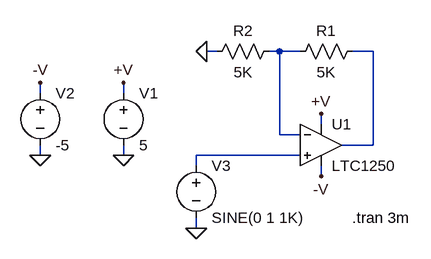
[diagram p0: schematic 1250.asc]
1250.asc, the LTspice schematic file:
Version 4
SHEET 1 896 680
WIRE 32 96 16 96
WIRE 128 96 112 96
WIRE 160 96 128 96
WIRE 272 96 240 96
WIRE -240 160 -240 144
WIRE -112 160 -112 144
WIRE 192 208 192 192
WIRE 128 224 128 96
WIRE 160 224 128 224
WIRE 272 240 272 96
WIRE 272 240 224 240
WIRE -240 256 -240 240
WIRE -112 256 -112 240
WIRE 160 256 0 256
WIRE 0 272 0 256
WIRE 192 288 192 272
WIRE 0 368 0 352
FLAG -112 256 0
FLAG 192 192 +V
FLAG -112 144 +V
FLAG 192 288 -V
FLAG -240 256 0
FLAG -240 144 -V
FLAG 16 96 0
FLAG 0 368 0
SYMBOL voltage -112 144 R0
SYMATTR InstName V1
SYMATTR Value 5
SYMBOL voltage -240 144 R0
SYMATTR InstName V2
SYMATTR Value -5
SYMBOL res 256 80 R90
WINDOW 0 0 56 VBottom 2
WINDOW 3 32 56 VTop 2
SYMATTR InstName R1
SYMATTR Value 5K
SYMBOL res 128 80 R90
WINDOW 0 0 56 VBottom 2
WINDOW 3 32 56 VTop 2
SYMATTR InstName R2
SYMATTR Value 5K
SYMBOL voltage 0 256 R0
SYMATTR InstName V3
SYMATTR Value SINE(0 1 1K)
SYMBOL opamps\\LTC1250 192 176 R0
SYMATTR InstName U1
TEXT 240 352 Left 2 !.tran 3m

The netlist it stands for:
* 1250.asc
V1 +V 0 5
V2 -V 0 -5
R1 N002 N001 5K
R2 N001 0 5K
V3 N003 0 SINE(0 1 1K)
XU1 N003 N001 +V -V N002 LTC1250  ; pins In+ In- V+ V- OUT
.tran 3m
.backanno
.end